# EasyEDA Pro project schmatic.epro

# Schematic Schematic1
Board Name: Board1; Create Date: 2026-01-16; Page Name: P1; Project Name: clight; Schematic Name: Schematic1; Update Date: 2026-01-16; Company: EasyEDA.com; Page Size: A4; Version: V1.0
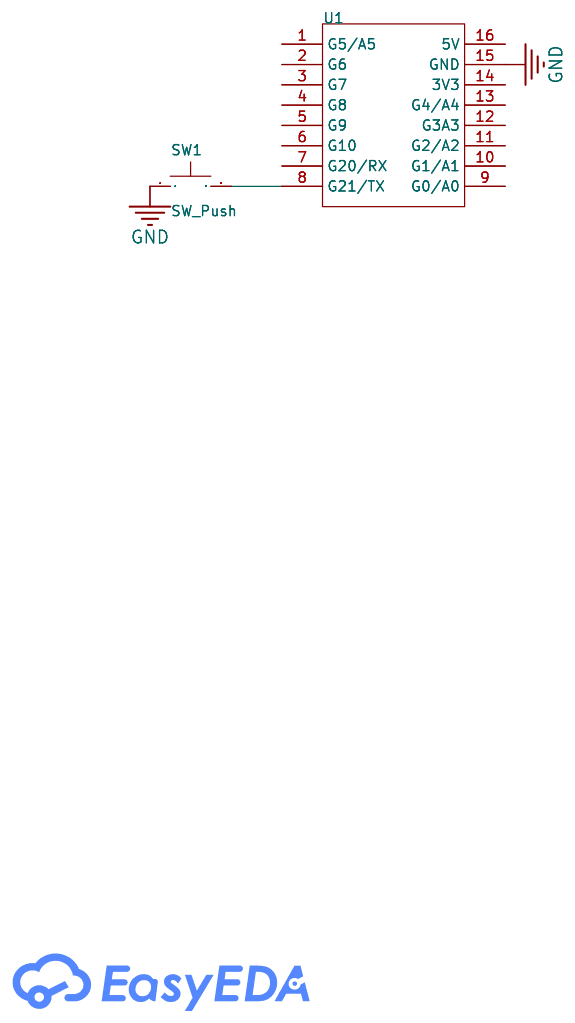
[diagram p0: schematic sheet]

## Parts
SW1  SW_Push  [Switch_Keyboard_Cherry_MX:SW_Cherry_MX_PCB_1.00u]
U1  -  [ESP32 C3 SUPER MINI]

## Library data of the parts
SW1 = SW_Push
U1 = ESP32 C3 SUPER MINI

## Nets
GND: SW1.1 U1.15(GND)
$1N305: SW1.2 U1.8(G21/TX)

Not connected (* = marked no-connect by the designer): U1 1(G5/A5) 2(G6) 3(G7) 4(G8) 5(G9) 6(G10) 7(G20/RX) 9(G0/A0) 10(G1/A1) 11(G2/A2) 12(G3A3) 13(G4/A4) 14(3V3) 16(5V)

# Board PCB1
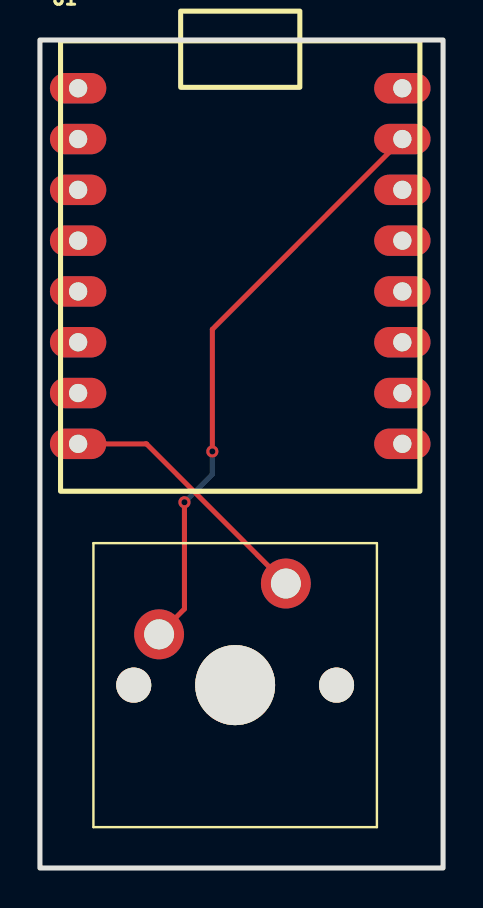
[diagram p1: board, top side]
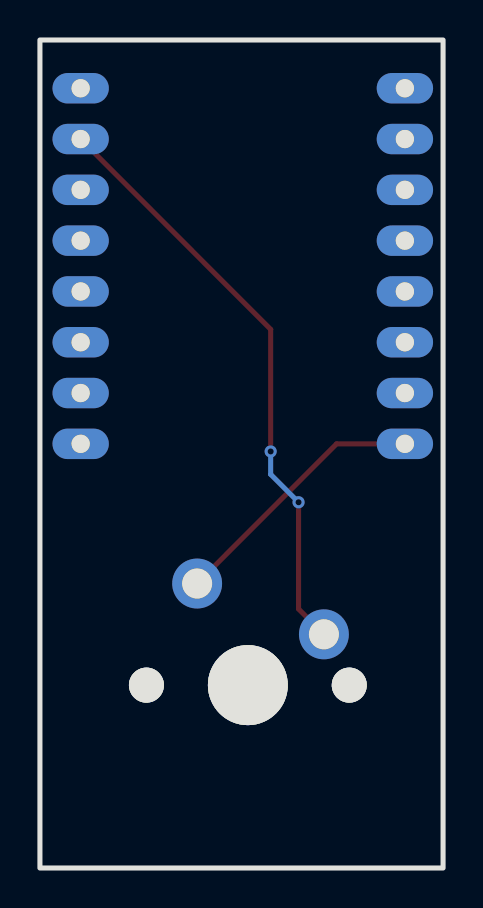
[diagram p2: board, bottom side, seen from below]

Outline 20.19 x 41.4 mm; copper layers: Top Layer, Bottom Layer. Coordinates in mm from the lower left corner of the outline.
Outline path: rectangle 0,41.4 20.19,0
Stack: Top Layer 0.035mm / Dielectric1 1.51mm FR4 er 4.5 / Bottom Layer 0.035mm

## Design rules (mm)
template: JLCPCB Capability(Two Layers Board)
spacing copperThickness1oz (default): track to track 0.102, other pairs 0.152 to 0.3
spacing copperThickness2oz: track to track 0.203, other pairs 0.152 to 0.3
track width copperThickness1oz (default): min 0.127, default 0.254, max 2.54
track width copperThickness2oz: min 0.203, default 0.254, max 2.54
differential pair differentialPair (default): width min 0.127, default 0.254, max 2.54; gap min 0.152, default 0.152
via viaSize (default): diameter min 0.5, default 0.61, max 10; hole min 0.3, default 0.305, max 6.3

## Placement (name value [footprint] x y rotation side)
SW1  SW_Push  [Switch_Keyboard_Cherry_MX:SW_Cherry_MX_PCB_1.00u]  9.78 9.14 0 top
U1  -  [ESP32 C3 SUPER MINI]  10.03 30.1 0 top

## Footprints (pads in the part's own frame, mm; a bottom-side part is the same pattern mirrored in y, then rotated)
ESP32 C3 SUPER MINI
  oval 2.824x1.524 hole 0.914: 1(-8.12,8.89) 2(-8.12,6.35) 3(-8.12,3.81) 4(-8.12,1.27) 5(-8.12,-1.27) 6(-8.12,-3.81) 7(-8.12,-6.35) 8(-8.12,-8.89) 9(8.12,-8.89) 10(8.12,-6.35) 11(8.12,-3.81) 12(8.12,-1.27) 13(8.12,1.27) 14(8.12,3.81) 15(8.12,6.35) 16(8.12,8.89)
Switch_Keyboard_Cherry_MX:SW_Cherry_MX_PCB_1.00u
  round 2.5 hole 1.5: 1(-3.81,2.54) 2(2.54,5.08)
  round 1.75 hole 1.75: 3(5.08,0) 5(-5.08,0)
  round 4 hole 4: 4(0,0)

## Nets
As in the schematic.

Pads without a net: SW1 3 4 5; U1 1 2 3 4 5 6 7 9 10 11 12 13 14 16

## Via types
v1: diameter 0.61, hole 0.305, Top Layer to Bottom Layer, 2 vias

## Routing (per net, layer and track width the routed paths; a pad name or vN(x,y) marks a point on that pad's centre or on a via; arc(x,y) is an arc through that point)
GND: length 29.8
  Top Layer w0.254: SW1.1 7.24,12.95 v1(7.24,18.29) ; v1(8.64,20.83) 8.64,26.93 U1.15
  Bottom Layer w0.254: v1(7.24,18.29) 8.64,19.69 v1(8.64,20.83)
$1N305: length 13.3
  Top Layer w0.254: SW1.2 5.33,21.21 U1.8
